# Altium project VUE_PIC32_v1_0.PrjPCB
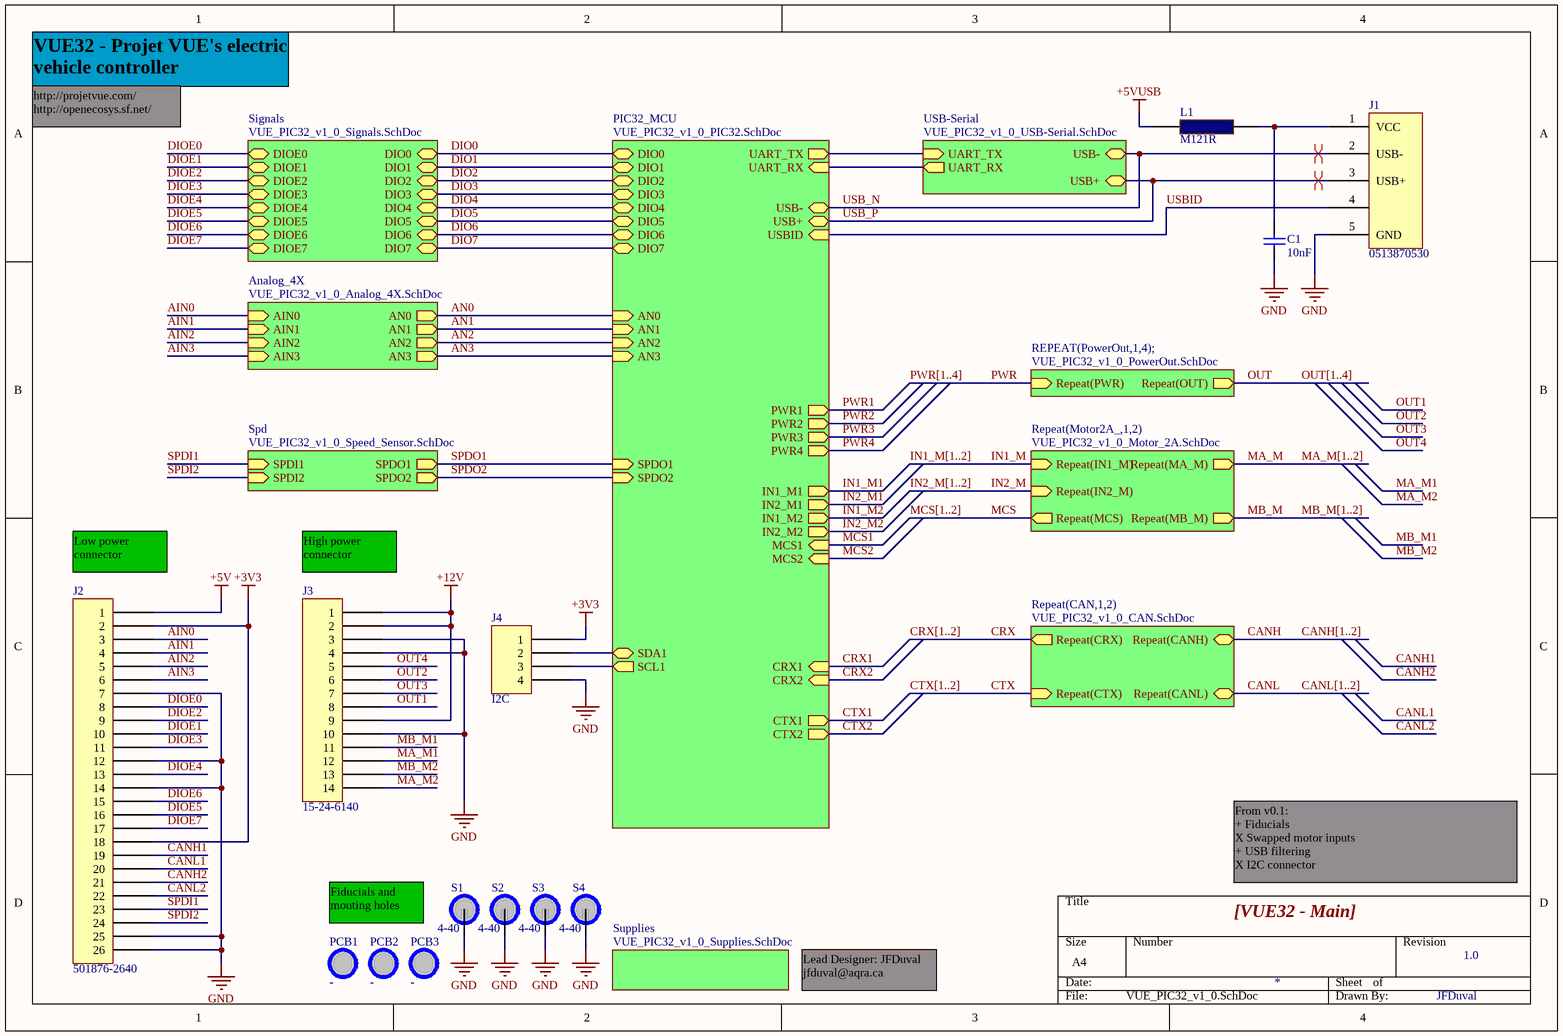
[diagram p0: VUE_PIC32_v1_0.SchDoc]
7 sheets, 160 parts. Net scope: hierarchical (ports join the sheet entries above them; power ports are global).
Board file: VUE_PIC32_v1_0.PcbDoc
Sheets:
  VUE_PIC32_v1_0.SchDoc
    REPEAT(PowerOut,1,4); = VUE_PIC32_v1_0_PowerOut.SchDoc
    Analog_4X = VUE_PIC32_v1_0_Analog_4X.SchDoc
    Supplies = VUE_PIC32_v1_0_Supplies.SchDoc
    Signals = VUE_PIC32_v1_0_Signals.SchDoc
    Motor2A_1 = VUE_PIC32_v1_0_Motor_2A.SchDoc
    Motor2A_2 = VUE_PIC32_v1_0_Motor_2A.SchDoc
    Spd = VUE_PIC32_v1_0_Speed_Sensor.SchDoc

## Sheet VUE_PIC32_v1_0.SchDoc: [VUE32 - Main]
size A4; Engineer: JFDuval; Revision: 1.0

### Parts
C1  10nF  [0402C]
J1  0513870530  [USB-MINI-B_MOLEX]
J2  501876-2640  [MOLEX_IGRID_26POS_RA]
J3  15-24-6140  [MINI-FIT_RA_14POS]
J4  I2C  [PINS_4POS_1_27MM]
L1  M121R  [0603]
PCB1  -  [FIDUCIAL]  (no BOM)
PCB2  -  [FIDUCIAL]  (no BOM)
PCB3  -  [FIDUCIAL]  (no BOM)
S1  4-40  [SCREW_4_40]
S2  4-40  [SCREW_4_40]
S3  4-40  [SCREW_4_40]
S4  4-40  [SCREW_4_40]

### Sub-sheets
Analog_4X = VUE_PIC32_v1_0_Analog_4X.SchDoc: AIN0 (in), AN0 (out), AIN2 (in), AN2 (out), AIN1 (in), AN1 (out), AIN3 (in), AN3 (out)
PIC32_MCU = VUE_PIC32_v1_0_PIC32.SchDoc (file not in this document): UART_TX (out), UART_RX (in), CRX1 (in), CTX1 (out), CRX2 (in), CTX2 (out), PWR2 (out), PWR1 (out), DIO0 (bidir), DIO1 (bidir), DIO2 (bidir), DIO3 (bidir), DIO4 (bidir), DIO5 (bidir), DIO6 (bidir), DIO7 (bidir), AN0 (in), AN1 (in), AN2 (in), AN3 (in), SDA1 (bidir), SCL1 (out), SPDO1 (in), USB- (bidir), USB+ (bidir), USBID (in), PWR3 (out), PWR4 (out), IN1_M1 (out), MCS1 (in), MCS2 (in), IN2_M1 (out), IN1_M2 (out), IN2_M2 (out), SPDO2 (in)
Repeat(CAN,1,2) = VUE_PIC32_v1_0_CAN.SchDoc (file not in this document): Repeat(CRX) (out), Repeat(CTX) (in), Repeat(CANH) (bidir), Repeat(CANL) (bidir)
Repeat(Motor2A_,1,2) = VUE_PIC32_v1_0_Motor_2A.SchDoc: Repeat(MCS) (out), Repeat(MA_M) (out), Repeat(MB_M) (out), Repeat(IN1_M) (in), Repeat(IN2_M) (in)
REPEAT(PowerOut,1,4); = VUE_PIC32_v1_0_PowerOut.SchDoc: Repeat(OUT) (out), Repeat(PWR) (in)
Signals = VUE_PIC32_v1_0_Signals.SchDoc: DIO0 (bidir), DIO1 (bidir), DIO2 (bidir), DIO3 (bidir), DIO4 (bidir), DIO5 (bidir), DIO6 (bidir), DIO7 (bidir), DIOE0 (bidir), DIOE1 (bidir), DIOE2 (bidir), DIOE3 (bidir), DIOE4 (bidir), DIOE5 (bidir), DIOE6 (bidir), DIOE7 (bidir)
Spd = VUE_PIC32_v1_0_Speed_Sensor.SchDoc: SPDI1 (in), SPDO1 (out), SPDI2 (in), SPDO2 (out)
Supplies = VUE_PIC32_v1_0_Supplies.SchDoc: no entries
USB-Serial = VUE_PIC32_v1_0_USB-Serial.SchDoc (file not in this document): UART_TX (in), UART_RX (out), USB- (bidir), USB+ (bidir)

### Nets
+3V3: J2.2 J2.18 J4.1
+5V: J2.1
+5VUSB: L1.1
+12V: J3.1 J3.2 J3.9
GND: C1.1 J1.5(GND) J2.7 J2.12 J2.14 J2.25 J2.26 J3.3 J3.4 J3.10 J4.4 S1.0 S2.0 S3.0 S4.0
AIN0: J2.3 ; sheet Analog_4X/AIN0
AIN1: J2.4 ; sheet Analog_4X/AIN1
AIN2: J2.5 ; sheet Analog_4X/AIN2
AIN3: J2.6 ; sheet Analog_4X/AIN3
AN0: sheet PIC32_MCU/AN0, sheet Analog_4X/AN0
AN1: sheet PIC32_MCU/AN1, sheet Analog_4X/AN1
AN2: sheet PIC32_MCU/AN2, sheet Analog_4X/AN2
AN3: sheet PIC32_MCU/AN3, sheet Analog_4X/AN3
CANH: sheet Repeat(CAN,1,2)/Repeat(CANH)
CANH1: J2.19
CANH2: J2.21
CANL: sheet Repeat(CAN,1,2)/Repeat(CANL)
CANL1: J2.20
CANL2: J2.22
CRX: sheet Repeat(CAN,1,2)/Repeat(CRX)
CRX1: sheet PIC32_MCU/CRX1
CRX2: sheet PIC32_MCU/CRX2
CTX: sheet Repeat(CAN,1,2)/Repeat(CTX)
CTX1: sheet PIC32_MCU/CTX1
CTX2: sheet PIC32_MCU/CTX2
DIO0: sheet PIC32_MCU/DIO0, sheet Signals/DIO0
DIO1: sheet PIC32_MCU/DIO1, sheet Signals/DIO1
DIO2: sheet PIC32_MCU/DIO2, sheet Signals/DIO2
DIO3: sheet PIC32_MCU/DIO3, sheet Signals/DIO3
DIO4: sheet PIC32_MCU/DIO4, sheet Signals/DIO4
DIO5: sheet PIC32_MCU/DIO5, sheet Signals/DIO5
DIO6: sheet PIC32_MCU/DIO6, sheet Signals/DIO6
DIO7: sheet PIC32_MCU/DIO7, sheet Signals/DIO7
DIOE0: J2.8 ; sheet Signals/DIOE0
DIOE1: J2.10 ; sheet Signals/DIOE1
DIOE2: J2.9 ; sheet Signals/DIOE2
DIOE3: J2.11 ; sheet Signals/DIOE3
DIOE4: J2.13 ; sheet Signals/DIOE4
DIOE5: J2.16 ; sheet Signals/DIOE5
DIOE6: J2.15 ; sheet Signals/DIOE6
DIOE7: J2.17 ; sheet Signals/DIOE7
IN1_M: sheet Repeat(Motor2A_,1,2)/Repeat(IN1_M)
IN2_M: sheet Repeat(Motor2A_,1,2)/Repeat(IN2_M)
MA_M: sheet Repeat(Motor2A_,1,2)/Repeat(MA_M)
MA_M1: J3.12
MA_M2: J3.14
MB_M: sheet Repeat(Motor2A_,1,2)/Repeat(MB_M)
MB_M1: J3.11
MB_M2: J3.13
MCS: sheet Repeat(Motor2A_,1,2)/Repeat(MCS)
OUT1: J3.8
OUT2: J3.6
OUT3: J3.7
OUT4: J3.5
PWR1: sheet PIC32_MCU/PWR1
PWR2: sheet PIC32_MCU/PWR2
PWR3: sheet PIC32_MCU/PWR3
PWR4: sheet PIC32_MCU/PWR4
SPDI1: J2.23 ; sheet Spd/SPDI1
SPDI2: J2.24 ; sheet Spd/SPDI2
SPDO1: sheet PIC32_MCU/SPDO1, sheet Spd/SPDO1
SPDO2: sheet PIC32_MCU/SPDO2, sheet Spd/SPDO2
USB_N: J1.2(USB-) ; sheet PIC32_MCU/USB-, sheet USB-Serial/USB-
USB_P: J1.3(USB+) ; sheet PIC32_MCU/USB+, sheet USB-Serial/USB+
USBID: J1.4 ; sheet PIC32_MCU/USBID
NetC1_2: C1.2 J1.1(VCC) L1.2
NetJ4_2: J4.2 ; sheet PIC32_MCU/SDA1
NetJ4_3: J4.3 ; sheet PIC32_MCU/SCL1
(unnamed): sheet PIC32_MCU/UART_TX, sheet USB-Serial/UART_TX
(unnamed): sheet PIC32_MCU/UART_RX, sheet USB-Serial/UART_RX

### Buses and harness runs
bus CANH[1..2]
bus CANL[1..2]
bus CRX[1..2]
bus CTX[1..2]
bus IN1_M[1..2]
bus IN2_M[1..2]
bus MA_M[1..2]
bus MB_M[1..2]
bus MCS[1..2]
bus OUT[1..4]
bus PWR[1..4]

### Layout directives
differential pair: USB_N, USB_P

### Notes on the sheet
- VUE32 - Projet VUE's electric vehicle controller
- http://projetvue.com/
  http://openecosys.sf.net/
  + USB filtering
- (near J2) Low power connector
- (near J3) High power connector
- Fiducials and mouting holes
- From v0.1:
  + Fiducials
  X Swapped motor inputs
  + USB filtering
  X I2C connector
- Lead Designer: JFDuval
  jfduval@aqra.ca
  + USB filtering

### Library data of the parts
C1 = CAP_TDK_C_0402_10nF_25V: CAP CER 10000PF 25V 10% X7R 0402; MfgPartNumber: C1005X7R1E103K; Mfg: TDK; Digikey: 445-1260-1-ND; Value: 10nF
J1 = CON_MOLEX_0513870530_USB_MINI_B: CONN RCPT MINIUSB B 5POS SMD R/A; Mfg: Molex Inc; MfgPartNumber: 0513870530; Value: 0513870530; Digikey: WM3756CT-ND
J2 = CON_MOLEX_IGRID_26POS_RA: CONN HEADER 26POS 2MM R/A TIN; Mfg: Molex Connector Corporation; MfgPartNumber: 501876-2640; Value: 501876-2640; Digikey: WM6091-ND
J3 = CON_MOLEX_MINI_FIT_JR_BMI_14POS_RA: CONN HEADER 14POS 4.2MM R/A TIN; Mfg: Molex Connector Corporation; MfgPartNumber: 15-24-6140; Value: 15-24-6140; Digikey: WM17803-ND
J4 = CON_NULL_4POS_1_27MM: 4 Holes 1.27mm; Value: H2x2; Mfg: -; MfgPartNumber: -; Digikey: -
L1 = FERRITE_LAIRD_MI0603M121R-10_0603_2_5A: FERRITE CHIP 2.5A 120 OHM SMD; Mfg: Laird-Signal Integrity Products; MfgPartNumber: MI0603M121R-10; Value: M121R; Digikey: 240-2375-1-ND
PCB1-PCB3 = FIDUCIAL_500UM: Fiducial; Mfg: -; MfgPartNumber: -; Value: -; Digikey: -
S1-S4 = SCREW_4_40: Mfg: -; MfgPartNumber: -; Value: 4-40; Digikey: -

## Sheet VUE_PIC32_v1_0_PowerOut.SchDoc: [VUE32 - (Up to) 10A switched output]
size A4; Engineer: JFDuval; Revision: 1.0
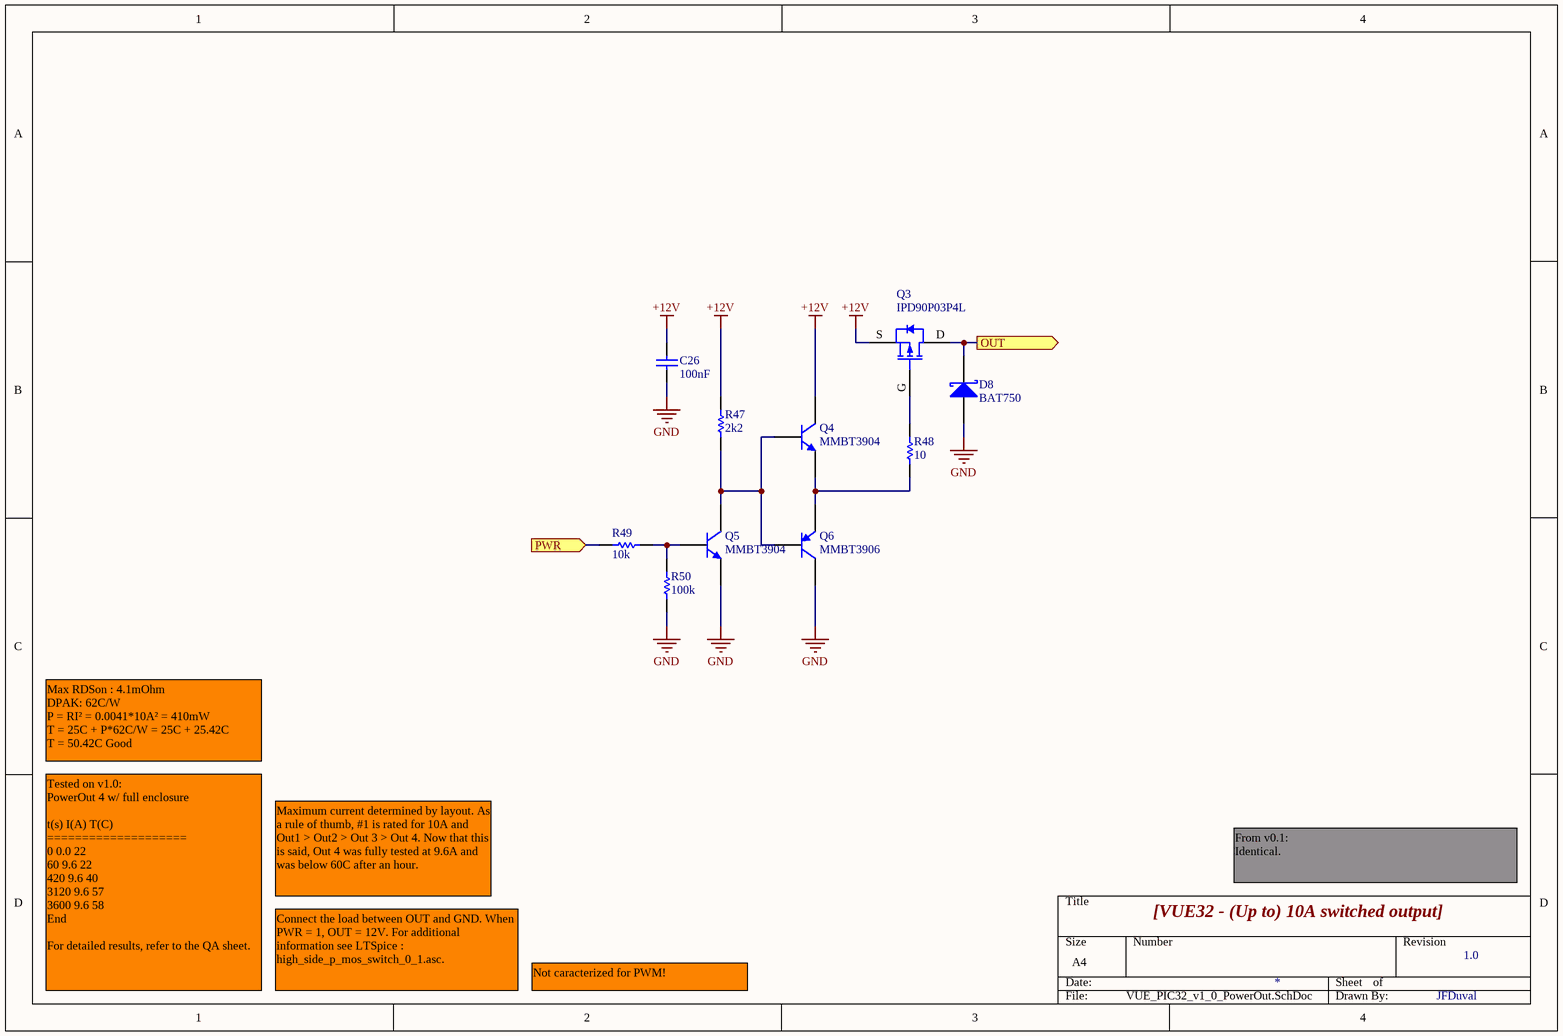
[diagram p1: VUE_PIC32_v1_0_PowerOut.SchDoc]

### Parts
C26  100nF  [0402C]
D8  BAT750  [SOT23-3]
Q3  IPD90P03P4L  [TO-252_DPAK]
Q4  MMBT3904  [SC-75/SOT-416]
Q5  MMBT3904  [SC-75/SOT-416]
Q6  MMBT3906  [SC-75/SOT-416]
R47  2k2  [0402]
R48  10  [0402]
R49  10k  [0402]
R50  100k  [0402]

### Ports
OUT (out), PWR (in)

### Nets
+12V: C26.2 Q3.S Q4.3(C) R47.2
GND: C26.1 D8.1(A) Q5.2(E) Q6.3(C) R50.1
OUT: D8.3(K) Q3.D ; port OUT
PWR: R49.1 ; port PWR
NetQ3_G: Q3.G R48.2
NetQ4_1: Q4.1(B) Q5.3(C) Q6.1(B) R47.1
NetQ4_2: Q4.2(E) Q6.2(E) R48.1
NetQ5_1: Q5.1(B) R49.2 R50.2

### Notes on the sheet
- Max RDSon : 4.1mOhm
  DPAK: 62C/W
  P = RI² = 0.0041*10A² = 410mW
  T = 25C + P*62C/W = 25C + 25.42C
  T = 50.42C Good
- Maximum current determined by layout. As a rule of thumb, #1 is rated for 10A and Out1 > Out2 > Out 3 > Out 4. Now that this is said, Out 4 was fully tested at 9.6A and was below 60C after an hour.
- From v0.1:
  Identical.
- Tested on v1.0:
  PowerOut 4 w/ full enclosure
  t(s)	I(A)	T(C)
  ====================
  0	0.0	22
  60	9.6	22
  420	9.6	40
  3120	9.6	57
  3600	9.6	58
  End
  For detailed results, refer to the QA sheet.
- Connect the load between OUT and GND. When PWR = 1, OUT = 12V. For additional information see LTSpice :
  high_side_p_mos_switch_0_1.asc.
- Not caracterized for PWM!

### Library data of the parts
C26 = CAP_TDK_C_0402_100nF_25V: CAP CER 0.1UF 25V Y5V 0402; MfgPartNumber: C1005Y5V1E104Z; Mfg: TDK; Value: 100nF; Digikey: 445-3445-1-ND
D8 = DIODE_DIODESINC_BAT750_SCHOTTKY_SOT23_40V_750MA: DIODE SCHOTTKY 40V 750MA SOT23-3; MfgPartNumber: BAT750TA; Mfg: Diodes/Zetex; Digikey: BAT750CT-ND; Value: BAT750
Q3 = MOSFET_INFINEON_P_CH_IOD90P03P4L_30V_DPAK: MOSFET P-CH 30V 90A TO252-3; MfgPartNumber: IPD90P03P4L-04; Mfg: Infineon Technologies; Digikey: IPD90P03P4L-04INCT-ND; Value: IPD90P03P4L
Q4 Q5 = BJT_ONSEMI_NPN_MMBT3904_40V_200MA_SC75: TRANS GP SS NPN 40V SOT416; MfgPartNumber: MMBT3904TT1G; Mfg: ON Semiconductor; Digikey: MMBT3904TT1GOSCT-ND; Value: MMBT3904
Q6 = BJT_ONSEMI_PNP_MMBT3906_40V_200MA_SC75: TRANS PNP GP 40V 200MA SC75-3; MfgPartNumber: MMBT3906TT1G; Mfg: ON Semiconductor; Digikey: MMBT3906TT1GOSCT-ND; Value: MMBT3906
R47 = RES_YAGEO_0402_2K2_1PCT: RES 2.20K OHM 1/16W 1% 0402 SMD; MfgPartNumber: RC0402FR-072K2L; Mfg: Yageo; Digikey: 311-2.20KLRCT-ND; Value: 2k2
R48 = RES_YAGEO_0402_10_1PCT: RES 10.0 OHM 1/16W 1% 0402 SMD; MfgPartNumber: RC0402FR-0710RL; Mfg: Yageo; Digikey: 311-10.0LRCT-ND; Value: 10
R49 = RES_YAGEO_0402_10K_1PCT: RES 10.0K OHM 1/16W 1% 0402 SMD; MfgPartNumber: RC0402FR-0710KL; Mfg: Yageo; Digikey: 311-10.0KLRCT-ND; Value: 10k
R50 = RES_YAGEO_0402_100K_1PCT: RES 100K OHM 1/16W 1% 0402 SMD; MfgPartNumber: RC0402FR-07100KL; Mfg: Yageo; Digikey: 311-100KLRCT-ND; Value: 100k

## Sheet VUE_PIC32_v1_0_Analog_4X.SchDoc: [VUE32 - 4 ch. analog inputs]
size A4; Engineer: JFDuval; Revision: 1.0
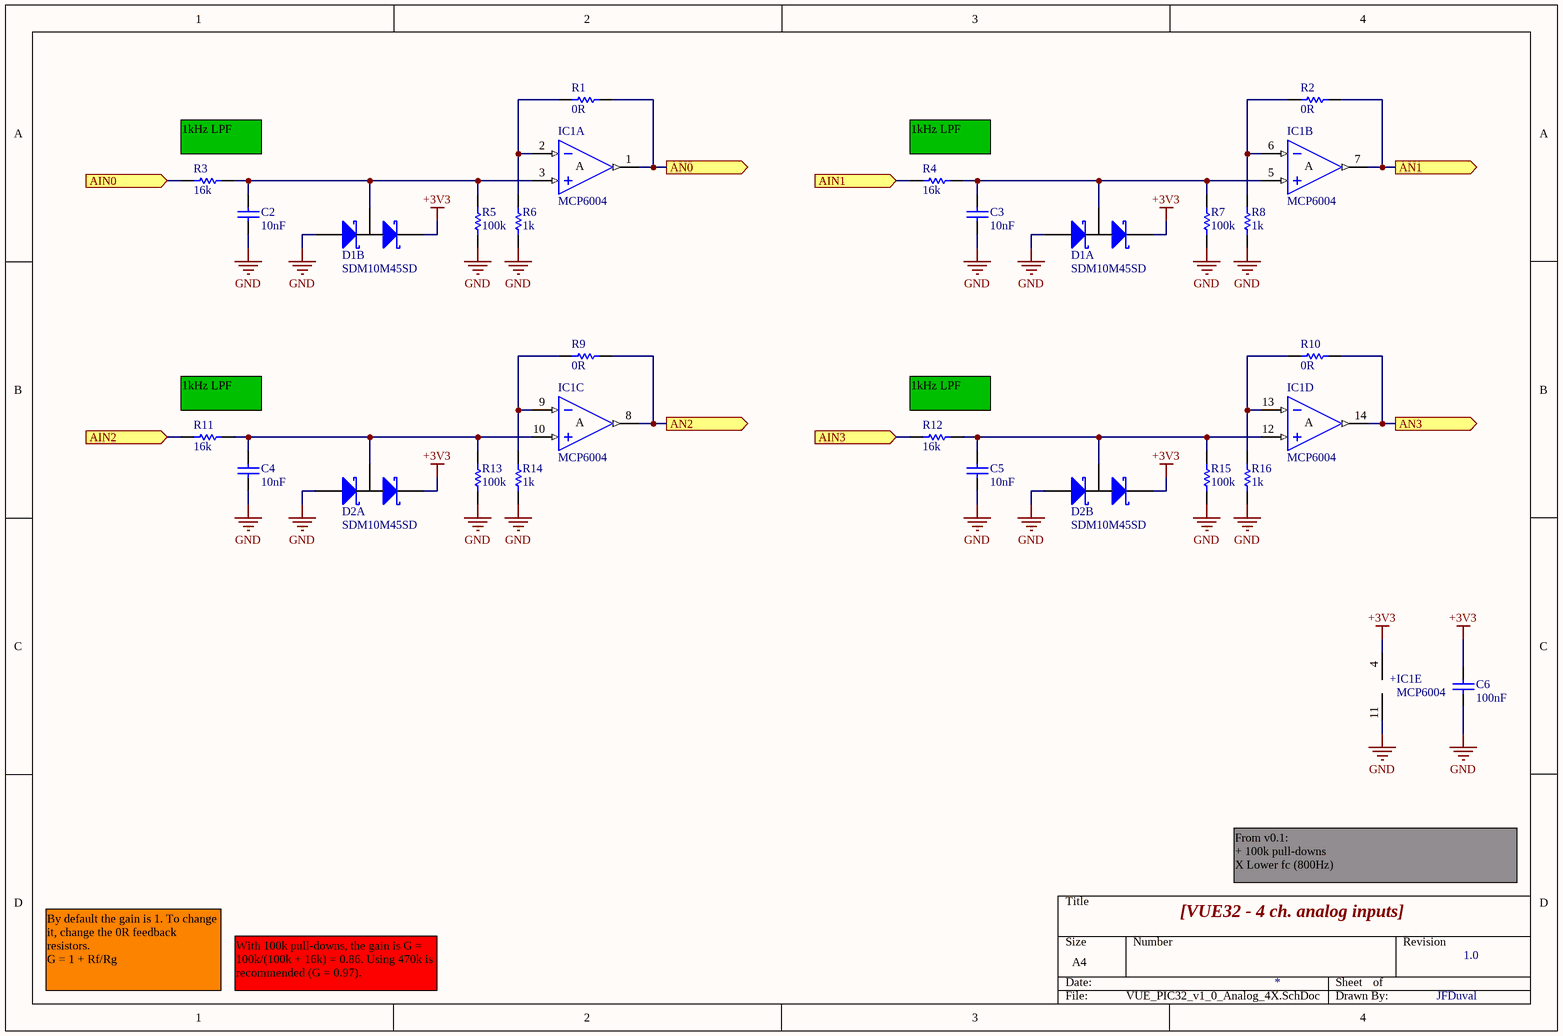
[diagram p2: VUE_PIC32_v1_0_Analog_4X.SchDoc]

### Parts
C2  10nF  [0402C]
C3  10nF  [0402C]
C4  10nF  [0402C]
C5  10nF  [0402C]
C6  100nF  [0402C]
D1  SDM10M45SD  [SOT23-6]  (parts A,B of 2)
D2  SDM10M45SD  [SOT23-6]  (parts A,B of 2)
IC1  MCP6004  [TSSOP14]  (parts A,B,C,D,E of 5)
R1  0R  [0402]
R2  0R  [0402]
R3  16k  [0402]
R4  16k  [0402]
R5  100k  [0402]
R6  value 1k  [0402]  (hidden comment: DNS)
R7  100k  [0402]
R8  value 1k  [0402]  (hidden comment: DNS)
R9  0R  [0402]
R10  0R  [0402]
R11  16k  [0402]
R12  16k  [0402]
R13  100k  [0402]
R14  value 1k  [0402]  (hidden comment: DNS)
R15  100k  [0402]
R16  value 1k  [0402]  (hidden comment: DNS)

### Ports
AIN0 (in), AIN1 (in), AIN2 (in), AIN3 (in), AN0 (out), AN1 (out), AN2 (out), AN3 (out)

### Nets
+3V3: C6.2 D1.2(K) D1.5(K) D2.2(K) D2.5(K) IC1.4(VDD)
GND: C2.1 C3.1 C4.1 C5.1 C6.1 D1.1(A) D1.4(A) D2.1(A) D2.4(A) IC1.11(VSS) R5.1 R6.1 R7.1 R8.1 R13.1 R14.1 R15.1 R16.1
AIN0: R3.1 ; port AIN0
AIN1: R4.1 ; port AIN1
AIN2: R11.1 ; port AIN2
AIN3: R12.1 ; port AIN3
AN0: IC1.1(OUT) R1.1 ; port AN0
AN1: IC1.7(OUT) R2.1 ; port AN1
AN2: IC1.8(OUT) R9.1 ; port AN2
AN3: IC1.14(OUT) R10.1 ; port AN3
NetC2_2: C2.2 D1.3(M) IC1.3(IN+) R3.2 R5.2
NetC3_2: C3.2 D1.6(M) IC1.5(IN+) R4.2 R7.2
NetC4_2: C4.2 D2.6(M) IC1.10(IN+) R11.2 R13.2
NetC5_2: C5.2 D2.3(M) IC1.12(IN+) R12.2 R15.2
NetIC1_2: IC1.2(IN-) R1.2 R6.2
NetIC1_6: IC1.6(IN-) R2.2 R8.2
NetIC1_9: IC1.9(IN-) R9.2 R14.2
NetIC1_13: IC1.13(IN-) R10.2 R16.2

### Notes on the sheet
- (near R3) 1kHz LPF
- (near R4) 1kHz LPF
- (near R11) 1kHz LPF
- (near R12) 1kHz LPF
- From v0.1:
  + 100k pull-downs
  X Lower fc (800Hz)
- By default the gain is 1. To change it, change the 0R feedback resistors.
  G = 1 + Rf/Rg
- With 100k pull-downs, the gain is G = 100k/(100k + 16k) = 0.86. Using 470k is recommended (G = 0.97).
- (in symbol IC_OPA_MICROCHIP_MCP6004_QUAD_TSSOP14, part A) A
- (in symbol IC_OPA_MICROCHIP_MCP6004_QUAD_TSSOP14, part B) A
- (in symbol IC_OPA_MICROCHIP_MCP6004_QUAD_TSSOP14, part C) A
- (in symbol IC_OPA_MICROCHIP_MCP6004_QUAD_TSSOP14, part D) A
- (in symbol IC_OPA_MICROCHIP_MCP6004_QUAD_TSSOP14, part E) +

### Library data of the parts
C2-C5 = CAP_TDK_C_0402_10nF_25V: as C1 on sheet VUE_PIC32_v1_0; Value: 10nF; Digikey: 445-1260-1-ND
C6 = CAP_TDK_C_0402_100nF_25V: as C26 on sheet VUE_PIC32_v1_0_PowerOut; Value: 100nF; Digikey: 445-3445-1-ND
D1 D2 = DIODE_DIODESINC_SDM10M45SD_QUAD_SCHOTTKY_45V_200MA: DIODE SCHOTTKY ARRAY 45V SOT26; MfgPartNumber: SDM10M45SD-7-F; Mfg: Diodes Inc; Digikey: SDM10M45SD-FDICT-ND; Value: SDM10M45SD
IC1 = IC_OPA_MICROCHIP_MCP6004_QUAD_TSSOP14: IC OPAMP QUAD 1.8V 14TSSOP; MfgPartNumber: MCP6004-I/ST; Mfg: Microchip Technology; Value: MCP6004; Digikey: MCP6004-I/ST-ND
R1 R2 R9 R10 = RES_YAGEO_0402_0R_1PCT: RES 0.0 OHM 1/16W 0402 SMD; MfgPartNumber: RC0402JR-070RL; Mfg: Yageo; Value: 0R; Digikey: 311-0.0JRCT-ND
R3 R4 R11 R12 = RES_YAGEO_0402_16K_1PCT: RES 16.0K OHM 1/16W 1% 0402 SMD; MfgPartNumber: RC0402FR-0716KL; Mfg: Yageo; Value: 16k; Digikey: 311-16.0KLRCT-ND
R5 R7 R13 R15 = RES_YAGEO_0402_100K_1PCT: as R50 on sheet VUE_PIC32_v1_0_PowerOut; Digikey: 311-100KLRCT-ND; Value: 100k
R6 R8 R14 R16 = RES_YAGEO_0402_1K_1PCT: RES 1.00K OHM 1/16W 1% 0402 SMD; MfgPartNumber: RC0402FR-071KL; Mfg: Yageo; Digikey: 311-1.00KLRCT-ND

## Sheet VUE_PIC32_v1_0_Supplies.SchDoc: [VUE32 - Supplies]
size A4; Engineer: JFDuval; Revision: 1.0
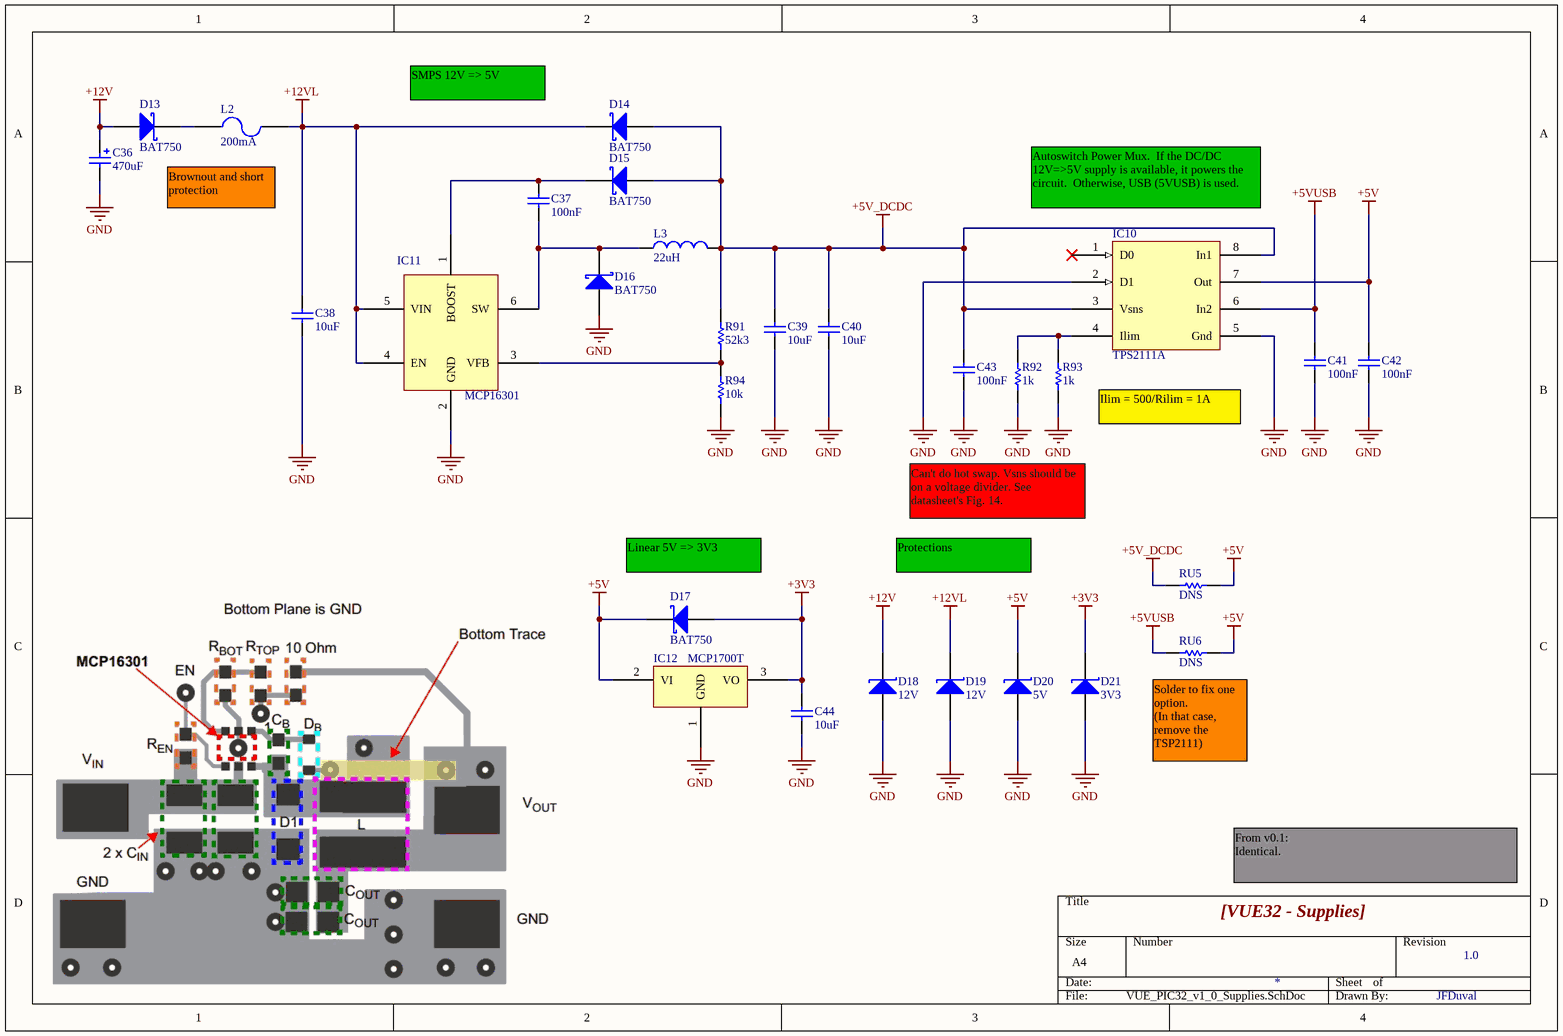
[diagram p3: VUE_PIC32_v1_0_Supplies.SchDoc]

### Parts
C36  470uF  [CAP_8D_15H_3_5mm]
C37  100nF  [0402C]
C38  10uF  [0805C]
C39  10uF  [0805C]
C40  10uF  [0805C]
C41  100nF  [0402C]
C42  100nF  [0402C]
C43  100nF  [0402C]
C44  10uF  [0805C]
D13  BAT750  [SOT23-3]
D14  BAT750  [SOT23-3]
D15  BAT750  [SOT23-3]
D16  BAT750  [SOT23-3]
D17  BAT750  [SOT23-3]
D18  value 12V  [SMA]  (hidden comment: SMA)
D19  value 12V  [SMA]  (hidden comment: SMA)
D20  5V  [Micro-SMP]
D21  3V3  [Micro-SMP]
IC10  TPS2111A  [TSSOP-8]
IC11  MCP16301  [SOT23-6]
IC12  MCP1700T  [SOT89-3]
L2  200mA  [1206_PTC]
L3  22uH  [1812L]
R91  52k3  [0402]
R92  value 1k  [0402]  (hidden comment: DNS)
R93  value 1k  [0402]  (hidden comment: DNS)
R94  10k  [0402]
RU5  DNS  [0603]
RU6  DNS  [0603]

### Nets
+3V3: C44.2 D17.1(A) D21.K IC12.3(VO)
+5V: C42.2 D17.3(K) D20.K IC10.7(Out) IC12.2(VI) RU5.2 RU6.2
+5V_DCDC: C39.2 C40.2 C43.2 D14.1(A) D15.1(A) IC10.3(Vsns) IC10.8(In1) L3.2 R91.2 RU5.1
+5VUSB: C41.2 IC10.6(In2) RU6.1
+12V: C36.A D13.1(A) D18.K
+12VL: C38.2 D14.3(K) D19.K IC11.4(EN) IC11.5(VIN) L2.2
GND: C36.K C38.1 C39.1 C40.1 C41.1 C42.1 C43.1 C44.1 D16.1(A) D18.A D19.A D20.A D21.A IC10.2(D1) IC10.5(Gnd) IC11.2(GND) IC12.1(GND) R92.1 R93.1 R94.1
NetC37_1: C37.1 D16.3(K) IC11.6(SW) L3.1
NetC37_2: C37.2 D15.3(K) IC11.1(BOOST)
NetD13_3: D13.3(K) L2.1
NetIC10_4: IC10.4(Ilim) R92.2 R93.2
NetIC11_3: IC11.3(VFB) R91.1 R94.2

Not connected (* = marked no-connect by the designer): IC10 1(D0)*

### Notes on the sheet
- SMPS 12V => 5V
- Brownout and short protection
- (near IC10) Autoswitch Power Mux.  If the DC/DC 12V=>5V supply is available, it powers the circuit.  Otherwise, USB (5VUSB) is used.
- Ilim = 500/Rilim = 1A
- Can't do hot swap. Vsns should be on a voltage divider. See datasheet's Fig. 14.
- (near D17) Linear 5V => 3V3
- Protections
- (near RU6) Solder to fix one option.
  (In that case, remove the TSP2111)
- From v0.1:
  Identical.

### Library data of the parts
C36 = CAP_UNITED_470UF_16V: CAP ALUM 470UF 16V 20% RADIAL; MfgPartNumber: EKY-160ELL471MH15D; Mfg: Panasonic - ECG; Digikey: 565-1524-ND; Value: 470uF
C37 C41-C43 = CAP_TDK_C_0402_100nF_25V: as C26 on sheet VUE_PIC32_v1_0_PowerOut; Value: 100nF; Digikey: 445-3445-1-ND
C38-C40 C44 = CAP_MURATA_C_0805_10uF_16V: CAP CER 10UF 16V Y5V 0805; MfgPartNumber: GRM21BF51C106ZE15L; Mfg: Murata; Digikey: 490-3347-1-ND; Value: 10uF
D13-D17 = DIODE_DIODESINC_BAT750_SCHOTTKY_SOT23_40V_750MA: as D8 on sheet VUE_PIC32_v1_0_PowerOut; Digikey: BAT750CT-ND; Value: BAT750
D18 D19 = DIODE_BOURNS_SMAJ12A_TVS_SMA_12V_400W: DIODE TVS 12V 400W UNI 5% SMD; Mfg: Bourns Inc.; MfgPartNumber: SMAJ12A; Digikey: SMAJ12ABCT-ND
D20 = DIODE_VISHAY_MSP5_TVS_MICROSMP_5V_100W: TVS UNIDIR 100W 5.0V MICROSMP; MfgPartNumber: MSP5.0A-M3/89A; Mfg: Vishay/General Semiconductor; Value: 5V; Digikey: MSP5.0A-M3/89AGICT-ND
D21 = DIODE_VISHAY_MSP3V3_TVS_MICROSMP_3V3_100W: TVS UNIDIR 100W 3.3V MICROSMP; MfgPartNumber: MSP3V3-M3/89A; Mfg: Vishay/General Semiconductor; Value: 3V3; Digikey: MSP3V3-M3/89AGICT-ND
IC10 = IC_PMIC_TI_TPS2111_AUTOSWITCH_POWER_MUX: IC AUTOSWITCH POWER MUX 8-TSSOP; MfgPartNumber: TPS2111APWR; Mfg: Texas Instruments; Value: TPS2111A; Digikey: 296-16936-1-ND
IC11 = IC_DCDC_MICROCHIP_MCP16301: IC REG BUCK ADJ 0.6A SOT23-6; MfgPartNumber: MCP16301T-I/CHY; Mfg: Microchip Technology; Value: MCP16301; Digikey: MCP16301T-I/CHYCT-ND
IC12 = IC_REG_MICROCHIP_MCP1700_3V3_SOT89: IC REG LDO 3.3V 250MA SOT-89-3; MfgPartNumber: MCP1700T-3302E/MB; Mfg: Microchip Technology; Value: MCP1700T; Digikey: MCP1700T3302EMBCT-ND
L2 = PTC_BELFUSE_200MA_30V_50MS_1206: PTC RESTTBLE 0.20A 30V CHIP 1206; MfgPartNumber: 0ZCA0020FF2E; Mfg: Bel Fuse Inc; Value: 200mA; Digikey: 507-1478-1-ND
L3 = L_WURTH_22uH_630MA_1812: INDUCTOR WW 22UH .63A 1812 SMD; MfgPartNumber: 744045220; Mfg: Wurth Electronics Inc; Value: 22uH; Digikey: 732-3074-1-ND
R91 = RES_PANASONIC_0402_52K3_1PCT: RES 52.3K OHM 1/10W 1% 0402 SMD; MfgPartNumber: ERJ-2RKF5232X; Mfg: Panasonic - ECG; Value: 52k3; Digikey: P52.3KLCT-ND
R92 R93 = RES_YAGEO_0402_1K_1PCT: as R6 on sheet VUE_PIC32_v1_0_Analog_4X; Digikey: 311-1.00KLRCT-ND
R94 = RES_YAGEO_0402_10K_1PCT: as R49 on sheet VUE_PIC32_v1_0_PowerOut; Value: 10k; Digikey: 311-10.0KLRCT-ND
RU5 RU6 = RES_DO_NOT_SOLDER_DNS_0603: Optional jumper - Do Not Solder; Mfg: NULL; MfgPartNumber: NULL; Digikey: NULL; Value: DNS

## Sheet VUE_PIC32_v1_0_Signals.SchDoc: [VUE32 - Digital I/Os]
size A4; Engineer: JFDuval; Revision: 1.0
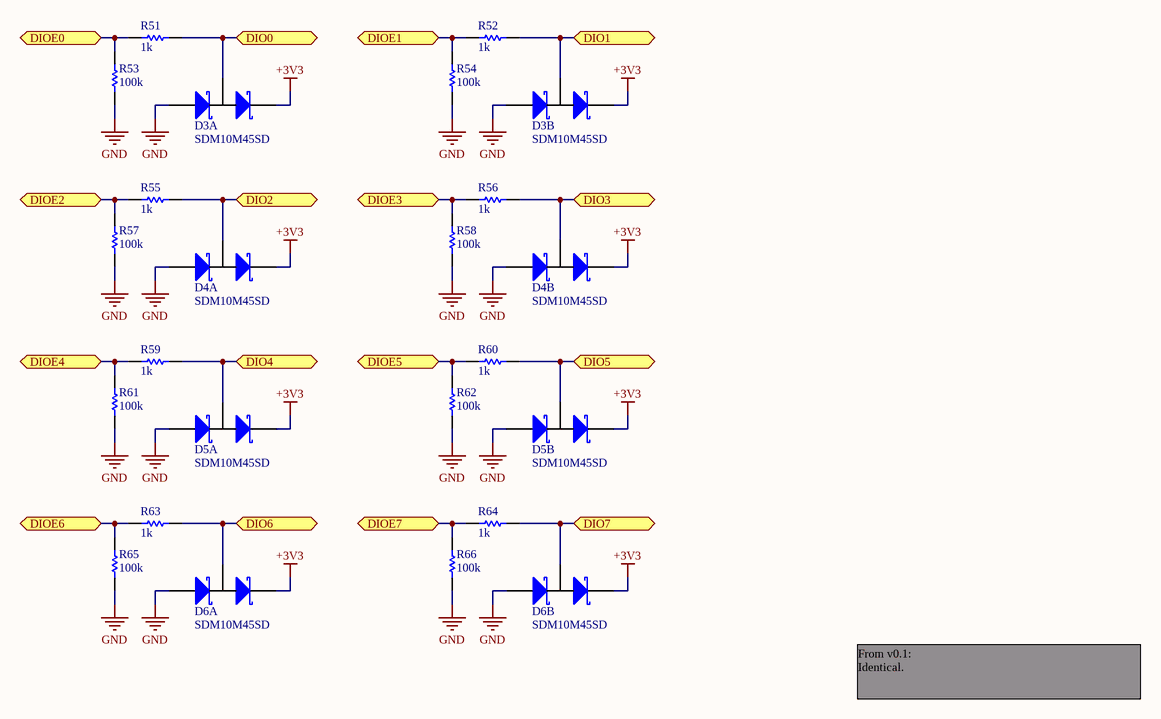
[diagram p4: VUE_PIC32_v1_0_Signals.SchDoc]

### Parts
D3  SDM10M45SD  [SOT23-6]  (parts A,B of 2)
D4  SDM10M45SD  [SOT23-6]  (parts A,B of 2)
D5  SDM10M45SD  [SOT23-6]  (parts A,B of 2)
D6  SDM10M45SD  [SOT23-6]  (parts A,B of 2)
R51  1k  [0402]
R52  1k  [0402]
R53  100k  [0402]
R54  100k  [0402]
R55  1k  [0402]
R56  1k  [0402]
R57  100k  [0402]
R58  100k  [0402]
R59  1k  [0402]
R60  1k  [0402]
R61  100k  [0402]
R62  100k  [0402]
R63  1k  [0402]
R64  1k  [0402]
R65  100k  [0402]
R66  100k  [0402]

### Ports
DIO0 (bidir), DIO1 (bidir), DIO2 (bidir), DIO3 (bidir), DIO4 (bidir), DIO5 (bidir), DIO6 (bidir), DIO7 (bidir), DIOE0 (bidir), DIOE1 (bidir), DIOE2 (bidir), DIOE3 (bidir), DIOE4 (bidir), DIOE5 (bidir), DIOE6 (bidir), DIOE7 (bidir)

### Nets
+3V3: D3.2(K) D3.5(K) D4.2(K) D4.5(K) D5.2(K) D5.5(K) D6.2(K) D6.5(K)
GND: D3.1(A) D3.4(A) D4.1(A) D4.4(A) D5.1(A) D5.4(A) D6.1(A) D6.4(A) R53.1 R54.1 R57.1 R58.1 R61.1 R62.1 R65.1 R66.1
DIO0: D3.6(M) R51.2 ; port DIO0
DIO1: D3.3(M) R52.2 ; port DIO1
DIO2: D4.6(M) R55.2 ; port DIO2
DIO3: D4.3(M) R56.2 ; port DIO3
DIO4: D5.6(M) R59.2 ; port DIO4
DIO5: D5.3(M) R60.2 ; port DIO5
DIO6: D6.6(M) R63.2 ; port DIO6
DIO7: D6.3(M) R64.2 ; port DIO7
DIOE0: R51.1 R53.2 ; port DIOE0
DIOE1: R52.1 R54.2 ; port DIOE1
DIOE2: R55.1 R57.2 ; port DIOE2
DIOE3: R56.1 R58.2 ; port DIOE3
DIOE4: R59.1 R61.2 ; port DIOE4
DIOE5: R60.1 R62.2 ; port DIOE5
DIOE6: R63.1 R65.2 ; port DIOE6
DIOE7: R64.1 R66.2 ; port DIOE7

### Notes on the sheet
- From v0.1:
  Identical.

### Library data of the parts
D3-D6 = DIODE_DIODESINC_SDM10M45SD_QUAD_SCHOTTKY_45V_200MA: as D1 on sheet VUE_PIC32_v1_0_Analog_4X; Mfg: Diodes Inc; Value: SDM10M45SD; Digikey: SDM10M45SD-FDICT-ND
R51 R52 R55 R56 R59 R60 R63 R64 = RES_YAGEO_0402_1K_1PCT: as R6 on sheet VUE_PIC32_v1_0_Analog_4X; Value: 1k; Digikey: 311-1.00KLRCT-ND
R53 R54 R57 R58 R61 R62 R65 R66 = RES_YAGEO_0402_100K_1PCT: as R50 on sheet VUE_PIC32_v1_0_PowerOut; Value: 100k; Digikey: 311-100KLRCT-ND

## Sheet VUE_PIC32_v1_0_Motor_2A.SchDoc: [VUE32 - 2A H-Bridge motor driver]
size A4; Engineer: JFDuval; Revision: 1.0
Used 2 times, as channels Motor2A_1, Motor2A_2. Parts and nets are listed once, with the designators drawn on the sheet.
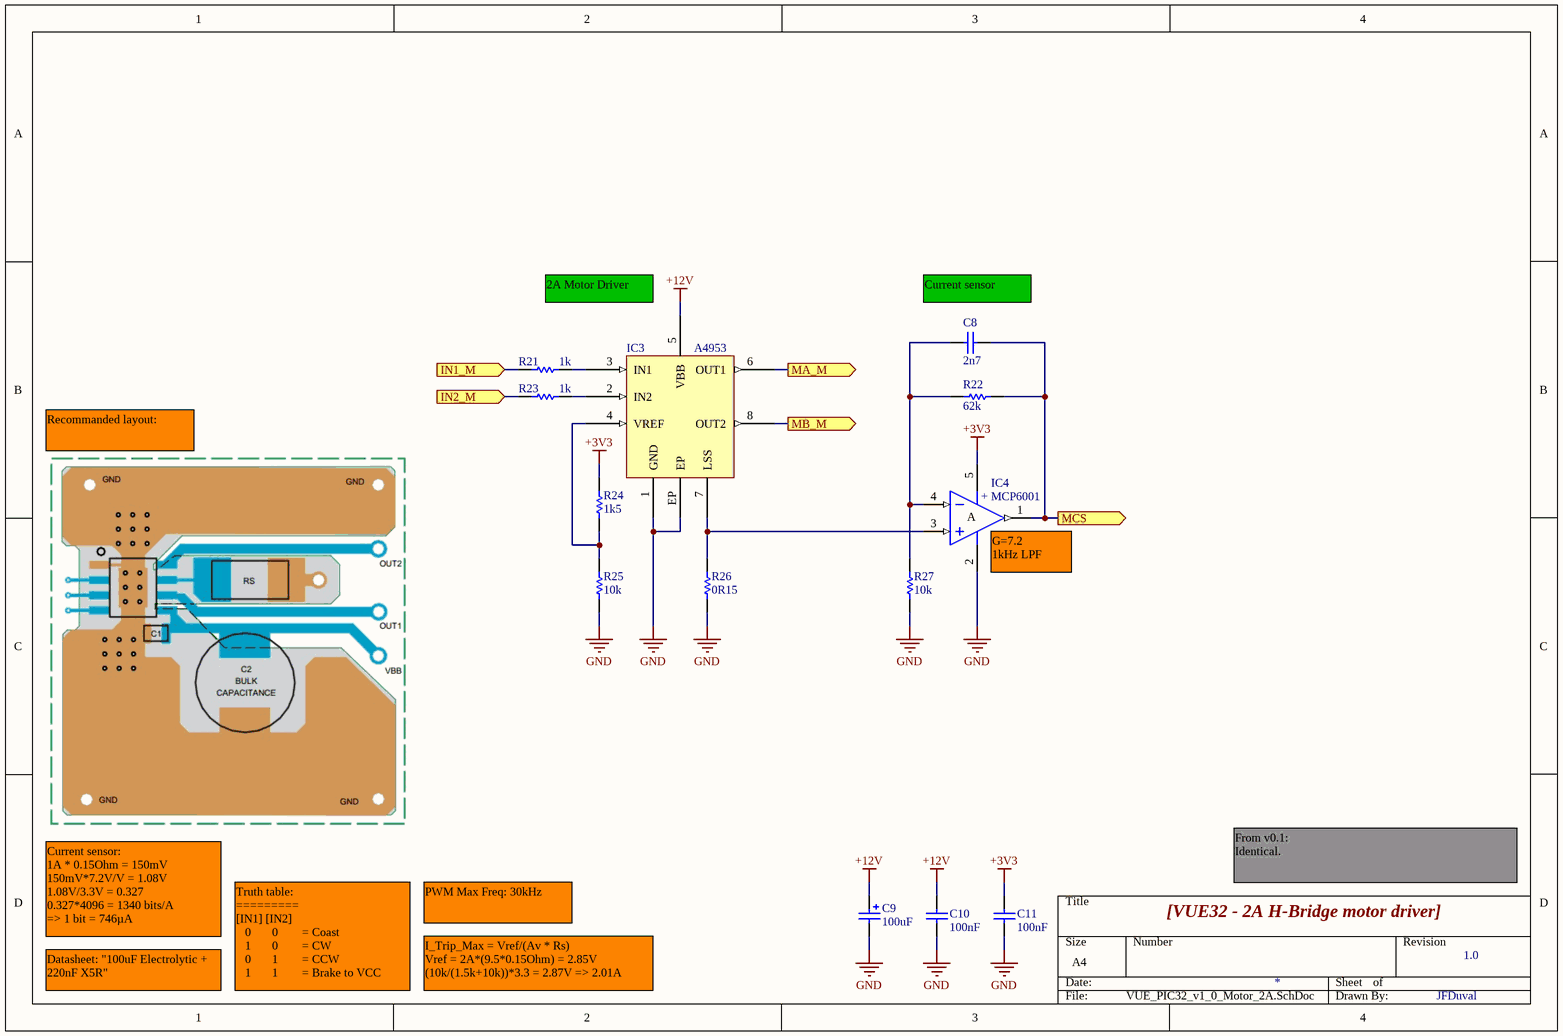
[diagram p5: VUE_PIC32_v1_0_Motor_2A.SchDoc]

### Parts
C8  2n7  [0402C]
C9  100uF  [CAP_PANA_D_D8]
C10  100nF  [0402C]
C11  100nF  [0402C]
IC3  A4953  [SOIC-8_PAD]
IC4  MCP6001  [SC70-5]
R21  1k  [0402]
R22  62k  [0402]
R23  1k  [0402]
R24  1k5  [0402]
R25  10k  [0402]
R26  0R15  [2512]
R27  10k  [0402]

### Ports
IN1_M (in), IN2_M (in), MA_M (out), MB_M (out), MCS (out)

### Nets
+3V3: C11.2 IC4.5(VDD) R24.2
+12V: C9.A C10.2 IC3.5(VBB)
GND: C9.K C10.1 C11.1 IC3.1(GND) IC3.EP IC4.2(VSS) R25.1 R26.1 R27.1
IN1_M: R21.1 ; port IN1_M
IN2_M: R23.1 ; port IN2_M
MA_M: IC3.6(OUT1) ; port MA_M
MB_M: IC3.8(OUT2) ; port MB_M
MCS: C8.2 IC4.1(OUT) R22.1 ; port MCS
NetC8_1: C8.1 IC4.4(IN-) R22.2 R27.2
NetIC3_2: IC3.2(IN2) R23.2
NetIC3_3: IC3.3(IN1) R21.2
NetIC3_4: IC3.4(VREF) R24.1 R25.2
NetIC3_7: IC3.7(LSS) IC4.3(IN+) R26.2

### Channels
Motor2A_1: designators end in A; ports IN1_M=IN1_M1 IN2_M=IN2_M1 MA_M=MA_M1 MB_M=MB_M1 MCS=MCS1
Motor2A_2: designators end in B; ports IN1_M=IN1_M2 IN2_M=IN2_M2 MA_M=MA_M2 MB_M=MB_M2 MCS=MCS2

### Notes on the sheet
- 2A Motor Driver
- (near C8) Current sensor
- Recommanded layout:
- (near IC4) G=7.2
  1kHz LPF
- PWM Max Freq: 30kHz
- From v0.1:
  Identical.
- Datasheet: "100uF Electrolytic + 220nF X5R"
- Current sensor:
  1A * 0.15Ohm = 150mV
  150mV*7.2V/V = 1.08V
  1.08V/3.3V = 0.327
  0.327*4096 = 1340 bits/A
  => 1 bit = 746µA
- Truth table:
  =========
  [IN1] [IN2]
  0       0        = Coast
  1       0        = CW
  0       1        = CCW
  1       1        = Brake to VCC
- I_Trip_Max = Vref/(Av * Rs)
  Vref = 2A*(9.5*0.15Ohm) = 2.85V
  (10k/(1.5k+10k))*3.3 = 2.87V => 2.01A
- (in symbol IC_OPA_MICROCHIP_MCP6001_SINGLE_SC70-5) +; A

### Library data of the parts
C8 = CAP_TDK_C_0402_2n7F_10V: CAP CER 2700PF 10V 5% SL 0402; MfgPartNumber: C1005SL1A272J; Mfg: TDK; Digikey: 445-2661-1-ND; Value: 2n7
C9 = CAP_PANASONIC_100UF_25V: CAP ALUM 100UF 25V 20% SMD; MfgPartNumber: EEE-FK1E101XP; Mfg: Panasonic - ECG; Digikey: PCE3797CT-ND; Value: 100uF
C10 C11 = CAP_TDK_C_0402_100nF_25V: as C26 on sheet VUE_PIC32_v1_0_PowerOut; Value: 100nF; Digikey: 445-3445-1-ND
IC3 = IC_ALLEGRO_A4953_MOTOR_HBRIDGE_40V_2A_SOIC8: IC PWM MOTOR DVR FULL 8SOIC; MfgPartNumber: A4953ELJTR-T; Mfg: Allegro Microsystems Inc; Value: A4953; Digikey: 620-1428-1-ND
IC4 = IC_OPA_MICROCHIP_MCP6001_SINGLE_SC70-5: IC OPAMP 1.8V 1MHZ SINGLE SC70-5; MfgPartNumber: MCP6001T-I/LT; Mfg: Microchip Technology; Value: MCP6001; Digikey: MCP6001T-I/LTCT-ND
R21 R23 = RES_YAGEO_0402_1K_1PCT: as R6 on sheet VUE_PIC32_v1_0_Analog_4X; Digikey: 311-1.00KLRCT-ND; Value: 1k
R22 = RES_YAGEO_0402_62K_1PCT: RES 62.0K OHM 1/16W 1% 0402 SMD; MfgPartNumber: RC0402FR-0762KL; Mfg: Yageo; Digikey: 311-62.0KLRCT-ND; Value: 62k
R24 = RES_YAGEO_0402_1K5_1PCT: RES 1.50K OHM 1/16W 1% 0402 SMD; MfgPartNumber: RC0402FR-071K5L; Mfg: Yageo; Digikey: 311-1.50KLRCT-ND; Value: 1k5
R25 R27 = RES_YAGEO_0402_10K_1PCT: as R49 on sheet VUE_PIC32_v1_0_PowerOut; Digikey: 311-10.0KLRCT-ND; Value: 10k
R26 = RES_TT_2512_0R15_1PCT_2W_CURRENT_SENSE: RES .150 OHM 2W 1% 2512 SMD; MfgPartNumber: LRC-LR2512LF-01-R150-F; Mfg: TT Electronics/IRC; Digikey: 989-1064-1-ND; Value: 0R15

## Sheet VUE_PIC32_v1_0_Speed_Sensor.SchDoc: [VUE32 - Speed Sensor]
size A4; Engineer: JFDuval; Revision: 1.0
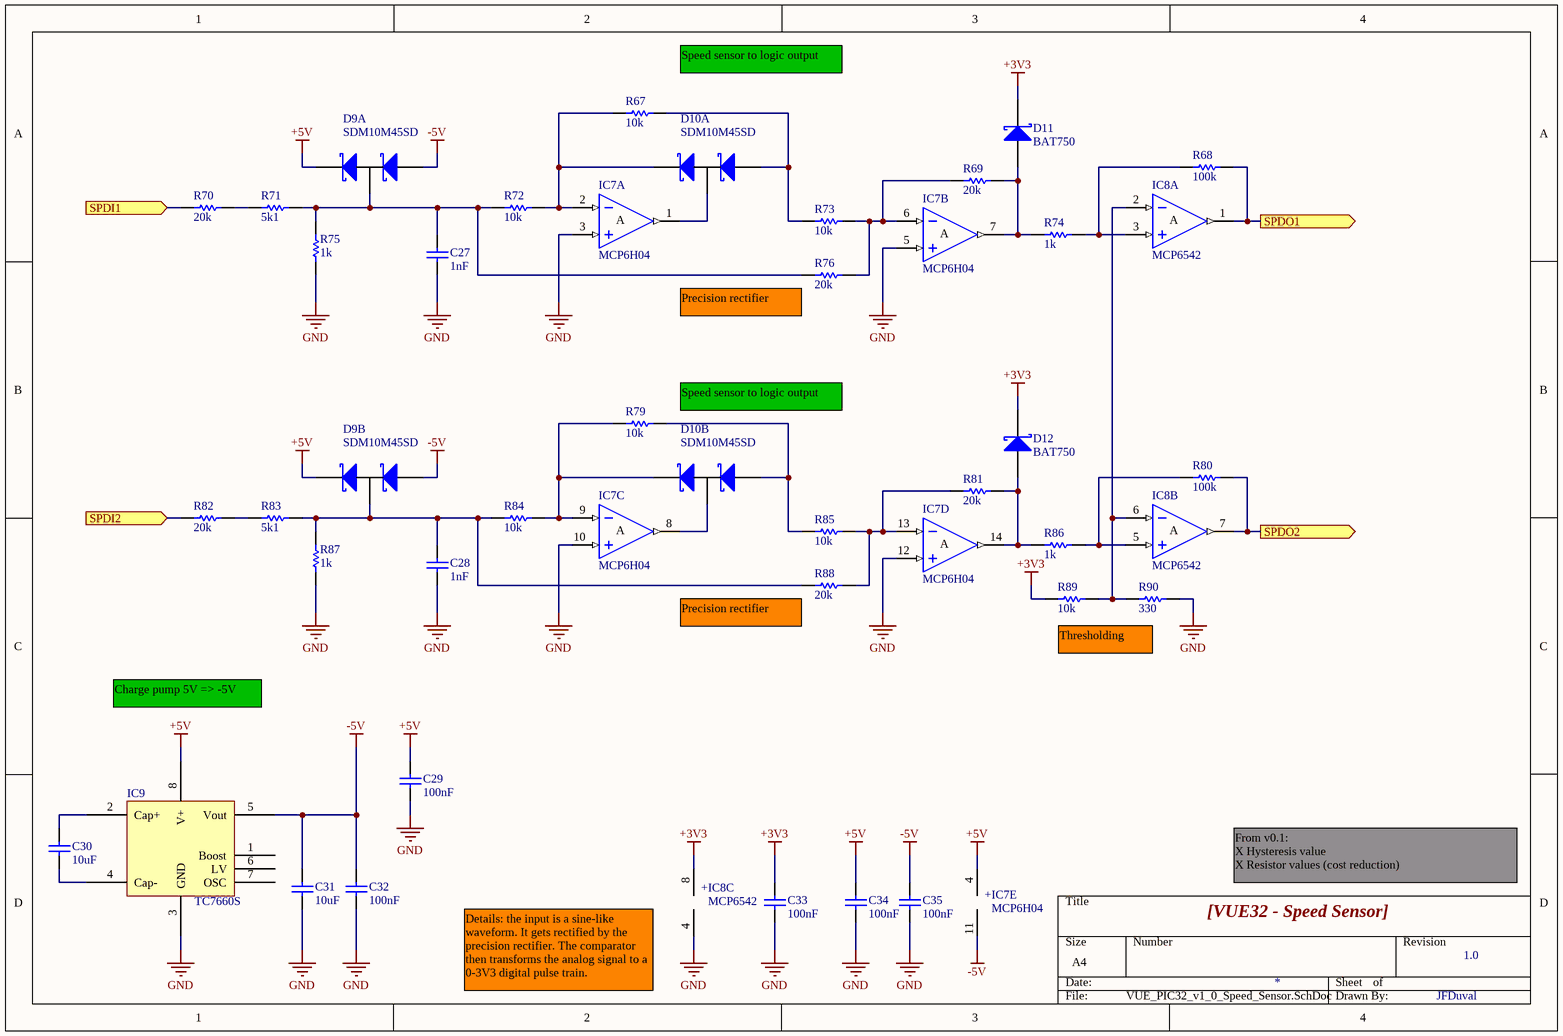
[diagram p6: VUE_PIC32_v1_0_Speed_Sensor.SchDoc]

### Parts
C27  1nF  [0402C]
C28  1nF  [0402C]
C29  100nF  [0402C]
C30  10uF  [0805C]
C31  10uF  [0805C]
C32  100nF  [0402C]
C33  100nF  [0402C]
C34  100nF  [0402C]
C35  100nF  [0402C]
D9  SDM10M45SD  [SOT23-6]  (parts A,B of 2)
D10  SDM10M45SD  [SOT23-6]  (parts A,B of 2)
D11  BAT750  [SOT23-3]
D12  BAT750  [SOT23-3]
IC7  MCP6H04  [TSSOP14]  (parts A,B,C,D,E of 5)
IC8  MCP6542  [MSOP-8]  (parts A,B,C of 3)
IC9  TC7660S  [SOIC-8]
R67  10k  [0402]
R68  100k  [0402]
R69  20k  [0402]
R70  20k  [0402]
R71  5k1  [0402]
R72  10k  [0402]
R73  10k  [0402]
R74  1k  [0402]
R75  1k  [0402]
R76  20k  [0402]
R79  10k  [0402]
R80  100k  [0402]
R81  20k  [0402]
R82  20k  [0402]
R83  5k1  [0402]
R84  10k  [0402]
R85  10k  [0402]
R86  1k  [0402]
R87  1k  [0402]
R88  20k  [0402]
R89  10k  [0402]
R90  330  [0402]

### Ports
SPDI1 (in), SPDI2 (in), SPDO1 (out), SPDO2 (out)

### Nets
+3V3: C33.2 D11.3(K) D12.3(K) IC8.8(VDD) R89.1
+5V: C29.2 C34.2 D9.2(K) D9.5(K) IC7.4(VDD) IC9.8(V+)
-5V: C31.2 C32.2 C35.2 D9.1(A) D9.4(A) IC7.11(VSS) IC9.5(Vout)
GND: C27.1 C28.1 C29.1 C31.1 C32.1 C33.1 C34.1 C35.1 IC7.3(IN+) IC7.5(IN+) IC7.10(IN+) IC7.12(IN+) IC8.4(VSS) IC9.3(GND) R75.1 R87.1 R90.2
SPDI1: R70.1 ; port SPDI1
SPDI2: R82.1 ; port SPDI2
SPDO1: IC8.1(OUT) R68.2 ; port SPDO1
SPDO2: IC8.7(OUT) R80.2 ; port SPDO2
NetC27_2: C27.2 D9.6(M) R71.1 R72.1 R75.2 R76.1
NetC28_2: C28.2 D9.3(M) R83.1 R84.1 R87.2 R88.1
NetC30_1: C30.1 IC9.4(Cap-)
NetC30_2: C30.2 IC9.2(Cap+)
NetD10_1: D10.1(A) R67.2 R73.1
NetD10_2: D10.2(K) IC7.2(IN-) R67.1 R72.2
NetD10_3: D10.3(M) IC7.8(OUT)
NetD10_4: D10.4(A) R79.2 R85.1
NetD10_5: D10.5(K) IC7.9(IN-) R79.1 R84.2
NetD10_6: D10.6(M) IC7.1(OUT)
NetD11_1: D11.1(A) IC7.7(OUT) R69.2 R74.2
NetD12_1: D12.1(A) IC7.14(OUT) R81.2 R86.2
NetIC7_6: IC7.6(IN-) R69.1 R73.2 R76.2
NetIC7_13: IC7.13(IN-) R81.1 R85.2 R88.2
NetIC8_2: IC8.2(IN-) IC8.6(IN-) R89.2 R90.1
NetIC8_3: IC8.3(IN+) R68.1 R74.1
NetIC8_5: IC8.5(IN+) R80.1 R86.1
NetR70_2: R70.2 R71.2
NetR82_2: R82.2 R83.2

Not connected (* = marked no-connect by the designer): IC9 1(Boost) 6(LV) 7(OSC)

### Notes on the sheet
- (near R67) Speed sensor to logic output
- (near R76) Precision rectifier
- (near R79) Speed sensor to logic output
- (near R88) Precision rectifier
- Thresholding
- Charge pump 5V => -5V
- From v0.1:
  X Hysteresis value
  X Resistor values (cost reduction)
- (near IC8) Details: the input is a sine-like waveform. It gets rectified by the precision rectifier. The comparator then transforms the analog signal to a 0-3V3 digital pulse train.
- (in symbol IC_COMP_MICROCHIP_MCP6542_DUAL_MSOP8, part A) A
- (in symbol IC_COMP_MICROCHIP_MCP6542_DUAL_MSOP8, part B) A
- (in symbol IC_COMP_MICROCHIP_MCP6542_DUAL_MSOP8, part C) +
- (in symbol IC_OPA_MICROCHIP_MCP6H04_QUAD_TSSOP14, part A) A
- (in symbol IC_OPA_MICROCHIP_MCP6H04_QUAD_TSSOP14, part B) A
- (in symbol IC_OPA_MICROCHIP_MCP6H04_QUAD_TSSOP14, part C) A
- (in symbol IC_OPA_MICROCHIP_MCP6H04_QUAD_TSSOP14, part D) A
- (in symbol IC_OPA_MICROCHIP_MCP6H04_QUAD_TSSOP14, part E) +

### Library data of the parts
C27 C28 = CAP_TDK_C_0402_1nF_25V: CAP CER 1000PF 25V 10% X7R 0402; MfgPartNumber: C1005X7R1E102K; Mfg: TDK; Digikey: 445-4924-1-ND; Value: 1nF
C29 C32-C35 = CAP_TDK_C_0402_100nF_25V: as C26 on sheet VUE_PIC32_v1_0_PowerOut; Digikey: 445-3445-1-ND; Value: 100nF
C30 C31 = CAP_MURATA_C_0805_10uF_16V: as C38 on sheet VUE_PIC32_v1_0_Supplies; Digikey: 490-3347-1-ND; Value: 10uF
D9 D10 = DIODE_DIODESINC_SDM10M45SD_QUAD_SCHOTTKY_45V_200MA: as D1 on sheet VUE_PIC32_v1_0_Analog_4X; Mfg: Diodes Inc; Digikey: SDM10M45SD-FDICT-ND; Value: SDM10M45SD
D11 D12 = DIODE_DIODESINC_BAT750_SCHOTTKY_SOT23_40V_750MA: as D8 on sheet VUE_PIC32_v1_0_PowerOut; Digikey: BAT750CT-ND; Value: BAT750
IC7 = IC_OPA_MICROCHIP_MCP6H04_QUAD_TSSOP14: IC OPAMP QUAD16V 1.2MHZ 14TSSOP; MfgPartNumber: MCP6H04-E/ST; Mfg: Microchip Technology; Value: MCP6H04; Digikey: MCP6H04-E/ST-ND
IC8 = IC_COMP_MICROCHIP_MCP6542_DUAL_MSOP8: IC COMP 1.6V DUAL P-P 8SOIC; MfgPartNumber: MCP6542-E/MS; Mfg: Microchip Technology; Value: MCP6542; Digikey: MCP6542-E/MS-ND
IC9 = IC_MICROCHIP_TC7660S_VOLT_INV_DBL_8SOIC: IC CHRG PUMP INV ADJ 20MA 8SOIC; MfgPartNumber: TC7660SEOA713; Mfg: Microchip Technology; Value: TC7660S; Digikey: TC7660SEOA713CT-ND
R67 R72 R73 R79 R84 R85 R89 = RES_YAGEO_0402_10K_1PCT: as R49 on sheet VUE_PIC32_v1_0_PowerOut; Digikey: 311-10.0KLRCT-ND; Value: 10k
R68 R80 = RES_YAGEO_0402_100K_1PCT: as R50 on sheet VUE_PIC32_v1_0_PowerOut; Digikey: 311-100KLRCT-ND; Value: 100k
R69 R70 R76 R81 R82 R88 = RES_YAGEO_0402_20K_1PCT: RES 20.0K OHM 1/16W 1% 0402 SMD; MfgPartNumber: RC0402FR-0720KL; Mfg: Yageo; Digikey: 311-20.0KLRCT-ND; Value: 20k
R71 R83 = RES_YAGEO_0402_5K1_1PCT: RES 5.10K OHM 1/16W 1% 0402 SMD; MfgPartNumber: RC0402FR-075K1L; Mfg: Yageo; Digikey: 311-5.10KLRCT-ND; Value: 5k1
R74 R75 R86 R87 = RES_YAGEO_0402_1K_1PCT: as R6 on sheet VUE_PIC32_v1_0_Analog_4X; Digikey: 311-1.00KLRCT-ND; Value: 1k
R90 = RES_YAGEO_0402_330_1PCT: RES 330 OHM 1/16W 1% 0402 SMD; MfgPartNumber: RC0402FR-07330RL; Mfg: Yageo; Digikey: 311-330LRCT-ND; Value: 330

## Nets that join several sheets
+3V3: VUE_PIC32_v1_0 (J2.2 J2.18 J4.1), VUE_PIC32_v1_0_Analog_4X (6 pins), VUE_PIC32_v1_0_Supplies (C44.2 D17.1 D21.K IC12.3), VUE_PIC32_v1_0_Signals (8 pins), Motor2A_1 (C11A.2 IC4A.5 R24A.2), Motor2A_2 (C11B.2 IC4B.5 R24B.2), VUE_PIC32_v1_0_Speed_Sensor (5 pins)
+5V: VUE_PIC32_v1_0 (J2.1), VUE_PIC32_v1_0_Supplies (7 pins), VUE_PIC32_v1_0_Speed_Sensor (6 pins)
+5VUSB: VUE_PIC32_v1_0 (L1.1), VUE_PIC32_v1_0_Supplies (C41.2 IC10.6 RU6.1)
+12V: VUE_PIC32_v1_0 (J3.1 J3.2 J3.9), VUE_PIC32_v1_0_PowerOut (C26.2 Q3.S Q4.3 R47.2), VUE_PIC32_v1_0_Supplies (C36.A D13.1 D18.K), Motor2A_1 (C9A.A C10A.2 IC3A.5), Motor2A_2 (C9B.A C10B.2 IC3B.5)
GND: VUE_PIC32_v1_0 (15 pins), VUE_PIC32_v1_0_PowerOut (5 pins), VUE_PIC32_v1_0_Analog_4X (18 pins), VUE_PIC32_v1_0_Supplies (20 pins), VUE_PIC32_v1_0_Signals (16 pins), Motor2A_1 (9 pins), Motor2A_2 (9 pins), VUE_PIC32_v1_0_Speed_Sensor (17 pins)
AIN0: VUE_PIC32_v1_0 (J2.3), VUE_PIC32_v1_0_Analog_4X (R3.1)
AIN1: VUE_PIC32_v1_0 (J2.4), VUE_PIC32_v1_0_Analog_4X (R4.1)
AIN2: VUE_PIC32_v1_0 (J2.5), VUE_PIC32_v1_0_Analog_4X (R11.1)
AIN3: VUE_PIC32_v1_0 (J2.6), VUE_PIC32_v1_0_Analog_4X (R12.1)
DIOE0: VUE_PIC32_v1_0 (J2.8), VUE_PIC32_v1_0_Signals (R51.1 R53.2)
DIOE1: VUE_PIC32_v1_0 (J2.10), VUE_PIC32_v1_0_Signals (R52.1 R54.2)
DIOE2: VUE_PIC32_v1_0 (J2.9), VUE_PIC32_v1_0_Signals (R55.1 R57.2)
DIOE3: VUE_PIC32_v1_0 (J2.11), VUE_PIC32_v1_0_Signals (R56.1 R58.2)
DIOE4: VUE_PIC32_v1_0 (J2.13), VUE_PIC32_v1_0_Signals (R59.1 R61.2)
DIOE5: VUE_PIC32_v1_0 (J2.16), VUE_PIC32_v1_0_Signals (R60.1 R62.2)
DIOE6: VUE_PIC32_v1_0 (J2.15), VUE_PIC32_v1_0_Signals (R63.1 R65.2)
DIOE7: VUE_PIC32_v1_0 (J2.17), VUE_PIC32_v1_0_Signals (R64.1 R66.2)
MA_M1: VUE_PIC32_v1_0 (J3.12), Motor2A_1 (IC3A.6)
MA_M2: VUE_PIC32_v1_0 (J3.14), Motor2A_2 (IC3B.6)
MB_M1: VUE_PIC32_v1_0 (J3.11), Motor2A_1 (IC3A.8)
MB_M2: VUE_PIC32_v1_0 (J3.13), Motor2A_2 (IC3B.8)
SPDI1: VUE_PIC32_v1_0 (J2.23), VUE_PIC32_v1_0_Speed_Sensor (R70.1)
SPDI2: VUE_PIC32_v1_0 (J2.24), VUE_PIC32_v1_0_Speed_Sensor (R82.1)